# EAGLE design romboard_v2 (EAGLE 9.4.2)
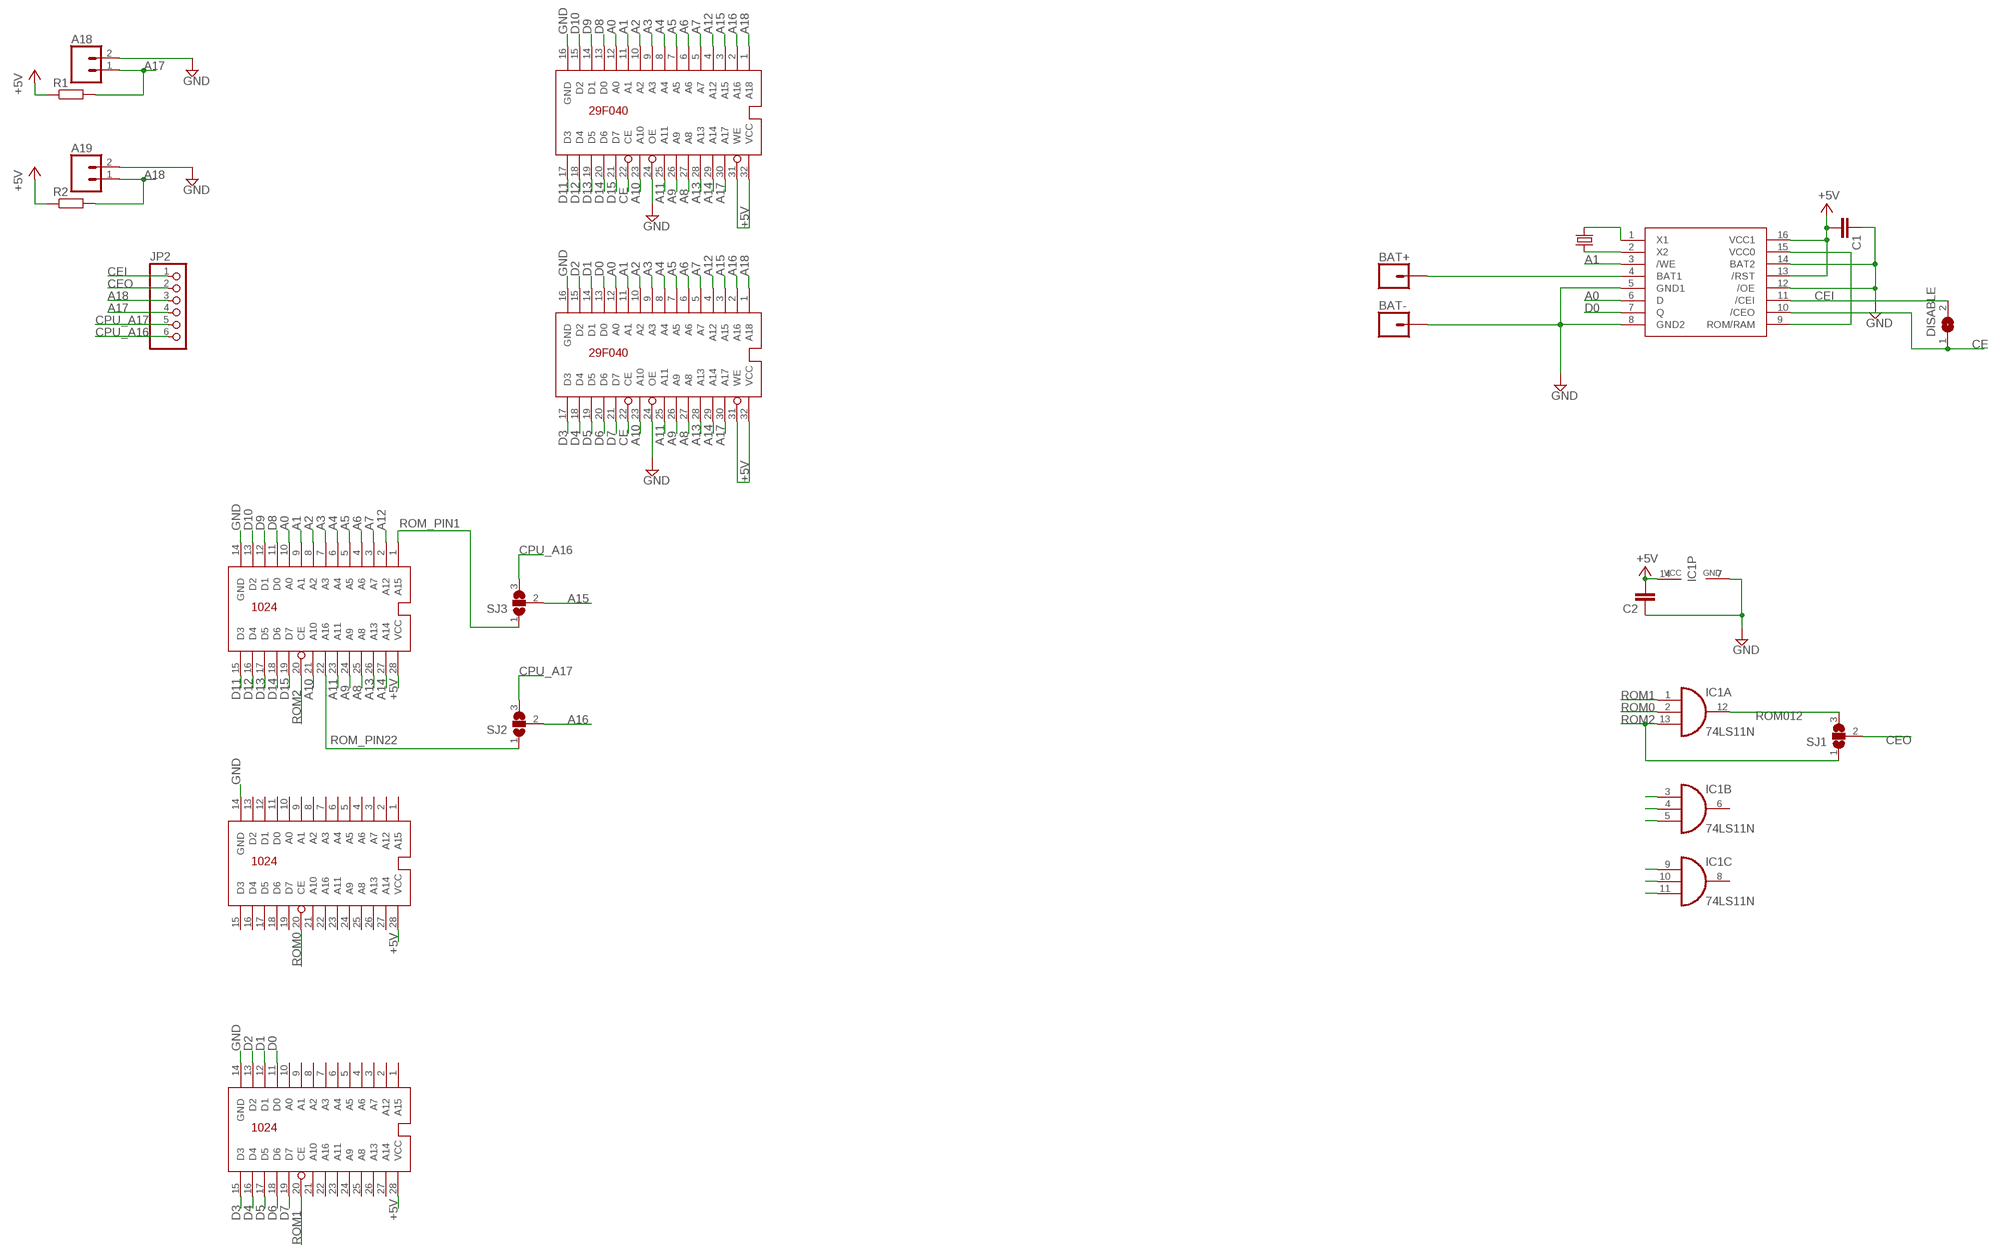
[diagram p0: schematic, sheet 1]

## Parts
32.768KHZ  CRYSTALTC38H  [TC38H]
A18  CONN_02  [1X02]
A19  CONN_02  [1X02]
BAT+  CONN_01  [1X01]
BAT-  CONN_01  [1X01]
C1  C-EU050-025X075  [C050-025X075]
C2  C-EU050-025X075  [C050-025X075]
DISABLE  SJ  [SJ]
HI0_SOCKET  ROM1024  [ROM28PIN]
IC1  74LS11N  [DIL14]
JP2  PINHD-1X6/90  [1X06/90]
LO2_SOCKET  ROM1024  [ROM28PIN]
LO2_SOCKET1  ROM1024  [ROM28PIN]
R1  R-EU_0207/12  [0207/12]
R2  R-EU_0207/12  [0207/12]
SJ1  SJ2W  [SJ_2]
SJ2  SJ2W  [SJ_2]
SJ3  SJ2W  [SJ_2]
U$1  AM29F040  [AM29F040]
U$2  AM29F040  [AM29F040]
U$4  DS1315  [DIL16]

## Nets
+5V: C1.2 C2.2 HI0_SOCKET.28(VCC) IC1.14(P:VCC) LO2_SOCKET1.28(VCC) LO2_SOCKET.28(VCC) R1.1 R2.1 U$1.31(WE) U$1.32(VCC) U$2.31(WE) U$2.32(VCC) U$4.13(/RST) U$4.16(VCC1)
A0: HI0_SOCKET.10(A0) U$1.12(A0) U$2.12(A0) U$4.6(D)
A1: HI0_SOCKET.9(A1) U$1.11(A1) U$2.11(A1) U$4.3(/WE)
A2: HI0_SOCKET.8(A2) U$1.10(A2) U$2.10(A2)
A3: HI0_SOCKET.7(A3) U$1.9(A3) U$2.9(A3)
A4: HI0_SOCKET.6(A4) U$1.8(A4) U$2.8(A4)
A5: HI0_SOCKET.5(A5) U$1.7(A5) U$2.7(A5)
A6: HI0_SOCKET.4(A6) U$1.6(A6) U$2.6(A6)
A7: HI0_SOCKET.3(A7) U$1.5(A7) U$2.5(A7)
A8: HI0_SOCKET.25(A8) U$1.27(A8) U$2.27(A8)
A9: HI0_SOCKET.24(A9) U$1.26(A9) U$2.26(A9)
A10: HI0_SOCKET.21(A10) U$1.23(A10) U$2.23(A10)
A11: HI0_SOCKET.23(A11) U$1.25(A11) U$2.25(A11)
A12: HI0_SOCKET.2(A12) U$1.4(A12) U$2.4(A12)
A13: HI0_SOCKET.26(A13) U$1.28(A13) U$2.28(A13)
A14: HI0_SOCKET.27(A14) U$1.29(A14) U$2.29(A14)
A15: SJ3.2 U$1.3(A15) U$2.3(A15)
A16: SJ2.2 U$1.2(A16) U$2.2(A16)
A17: A18.1 JP2.4 R1.2 U$1.30(A17) U$2.30(A17)
A18: A19.1 JP2.3 R2.2 U$1.1(A18) U$2.1(A18)
BAT: BAT+.1 U$4.4(BAT1)
CE: DISABLE.1 U$1.22(CE) U$2.22(CE) U$4.10(/CEO)
CEI: DISABLE.2 JP2.1 U$4.11(/CEI)
CEO: JP2.2 SJ1.2
CPU_A16: JP2.6 SJ3.3
CPU_A17: JP2.5 SJ2.3
D0: LO2_SOCKET.11(D0) U$1.13(D0) U$4.7(Q)
D1: LO2_SOCKET.12(D1) U$1.14(D1)
D2: LO2_SOCKET.13(D2) U$1.15(D2)
D3: LO2_SOCKET.15(D3) U$1.17(D3)
D4: LO2_SOCKET.16(D4) U$1.18(D4)
D5: LO2_SOCKET.17(D5) U$1.19(D5)
D6: LO2_SOCKET.18(D6) U$1.20(D6)
D7: LO2_SOCKET.19(D7) U$1.21(D7)
D8: HI0_SOCKET.11(D0) U$2.13(D0)
D9: HI0_SOCKET.12(D1) U$2.14(D1)
D10: HI0_SOCKET.13(D2) U$2.15(D2)
D11: HI0_SOCKET.15(D3) U$2.17(D3)
D12: HI0_SOCKET.16(D4) U$2.18(D4)
D13: HI0_SOCKET.17(D5) U$2.19(D5)
D14: HI0_SOCKET.18(D6) U$2.20(D6)
D15: HI0_SOCKET.19(D7) U$2.21(D7)
GND: A18.2 A19.2 BAT-.1 C1.1 C2.1 HI0_SOCKET.14(GND) IC1.7(P:GND) LO2_SOCKET1.14(GND) LO2_SOCKET.14(GND) U$1.16(GND) U$1.24(OE) U$2.16(GND) U$2.24(OE) U$4.5(GND1) U$4.8(GND2) U$4.12(/OE) U$4.14(BAT2)
N$2: U$4.9(ROM/RAM) U$4.15(VCC0)
N$3: IC1.11(C:I2)
N$4: IC1.10(C:I1)
N$5: IC1.9(C:I0)
N$6: IC1.5(B:I2)
N$7: IC1.4(B:I1)
N$8: IC1.3(B:I0)
ROM0: IC1.2(A:I1) LO2_SOCKET1.20(CE)
ROM1: IC1.1(A:I0) LO2_SOCKET.20(CE)
ROM2: HI0_SOCKET.20(CE) IC1.13(A:I2) SJ1.1
ROM012: IC1.12(A:O) SJ1.3
ROM_PIN1: HI0_SOCKET.1(A15) SJ3.1
ROM_PIN22: HI0_SOCKET.22(A16) SJ2.1
X1: 32.768KHZ.2 U$4.1(X1)
X2: 32.768KHZ.1 U$4.2(X2)
Unconnected: IC1.6(B:O) IC1.8(C:O) LO2_SOCKET1.1(A15) LO2_SOCKET1.2(A12) LO2_SOCKET1.3(A7) LO2_SOCKET1.4(A6) LO2_SOCKET1.5(A5) LO2_SOCKET1.6(A4) LO2_SOCKET1.7(A3) LO2_SOCKET1.8(A2) LO2_SOCKET1.9(A1) LO2_SOCKET1.10(A0) LO2_SOCKET1.11(D0) LO2_SOCKET1.12(D1) LO2_SOCKET1.13(D2) LO2_SOCKET1.15(D3) LO2_SOCKET1.16(D4) LO2_SOCKET1.17(D5) LO2_SOCKET1.18(D6) LO2_SOCKET1.19(D7) LO2_SOCKET1.21(A10) LO2_SOCKET1.22(A16) LO2_SOCKET1.23(A11) LO2_SOCKET1.24(A9) LO2_SOCKET1.25(A8) LO2_SOCKET1.26(A13) LO2_SOCKET1.27(A14) LO2_SOCKET.1(A15) LO2_SOCKET.2(A12) LO2_SOCKET.3(A7) LO2_SOCKET.4(A6) LO2_SOCKET.5(A5) LO2_SOCKET.6(A4) LO2_SOCKET.7(A3) LO2_SOCKET.8(A2) LO2_SOCKET.9(A1) LO2_SOCKET.10(A0) LO2_SOCKET.21(A10) LO2_SOCKET.22(A16) LO2_SOCKET.23(A11) LO2_SOCKET.24(A9) LO2_SOCKET.25(A8) LO2_SOCKET.26(A13) LO2_SOCKET.27(A14)

## Library data of the parts
32.768KHZ = crystal:CRYSTAL: CRYSTAL; OC_FARNELL: unknown; OC_NEWARK: unknown
A18 A19 = SparkFun-Connectors:CONN_02: Multi connection point. Often used as Generic Header-pin footprint for 0.1 inch spaced/style header connections On any of the 0.1 inch spaced packages, you can populate with these: Break Away Headers - Straight <https://www.sparkfun.com/products/116> (PRT-00116) Break Away Male Headers - Right Angle <https://www.sparkfun.com/products/553> (PRT-00553) Female Headers <https://www.sparkfun.com/products/115> (PRT-00115) Break Away Headers - Machine Pin <https://www.sparkfun.com/products/117> (PRT-00117) Break Away Female Headers - Swiss Machine Pin <https://www.sparkfun.com/products/743> (PRT-00743) For SCREWTERMINALS and SPRING TERMINALS visit here: Screw Terimnals on SparkFun.com <https://www.sparkfun.com/search/results?term=Screw+Terminals> (5mm/3.5mm/2.54mm spacing) This device is also useful as a general connection point to wire up your design to another part of your project. Our various solder wires solder well into these plated through hole pads. Hook-Up Wire - Assortment (Stranded, 22 AWG) <https://www.sparkfun.com/products/11375> (PRT-11375) Hook-Up Wire - Assortment (Solid Core, 22 AWG) <https://www.sparkfun.com/products/11367> (PRT-11367) View the entire wire category on our website here <https://www.sparkfun.com/categories/141> Special notes: Molex polarized connector foot print use with: PRT-08233 with associated crimp pins and housings. 2.54_SCREWTERM for use with PRT-10571. 3.5mm Screw Terminal footprints for PRT-08084 5mm Screw Terminal footprints for use with PRT-08432
BAT+ BAT- = SparkFun-Connectors:CONN_01: Single connection point. Often used as Generic Header-pin footprint for 0.1 inch spaced/style header connections On any of the 0.1 inch spaced packages, you can populate with these: Break Away Headers - Straight <https://www.sparkfun.com/products/116> (PRT-00116) Break Away Male Headers - Right Angle <https://www.sparkfun.com/products/553> (PRT-00553) Female Headers <https://www.sparkfun.com/products/115> (PRT-00115) Break Away Headers - Machine Pin <https://www.sparkfun.com/products/117> (PRT-00117) Break Away Female Headers - Swiss Machine Pin <https://www.sparkfun.com/products/743> (PRT-00743) This device is also useful as a general connection point to wire up your design to another part of your project. Our various solder wires solder well into these plated through hole pads. Hook-Up Wire - Assortment (Stranded, 22 AWG) <https://www.sparkfun.com/products/11375> (PRT-11375) Hook-Up Wire - Assortment (Solid Core, 22 AWG) <https://www.sparkfun.com/products/11367> (PRT-11367) View the entire wire category on our website here <https://www.sparkfun.com/categories/141> Special notes: SMTSO-256-ET is a "flush mount" nut for a 4-40 screw. We mostly use this on specialty testbeds; it is a nice way to connect hardware to your PCB at an adjustable hieght. Also note, the SNAP packages are for using a snappable style connector. We sell a baggie of snaps and they are also used on two LilyPad designs: Snap Assortment - 30 pack (male and female) <https://www.sparkfun.com/products/11347> (DEV-11347) LilyPad Arduino SimpleSnap <https://www.sparkfun.com/products/10941> (DEV-10941) LilyPad SimpleSnap Protoboard <https://www.sparkfun.com/products/10940> (DEV-10940)
C1 C2 = rcl:C-EU: CAPACITOR, European symbol; SPICEPREFIX: C
DISABLE = jumper:SJ: SMD solder JUMPER
HI0_SOCKET LO2_SOCKET LO2_SOCKET1 = AtariST:ROM1024
IC1 = 74xx-eu:74*11: Triple 3-input AND gate
JP2 = pinhead:PINHD-1X6: PIN HEADER
R1 R2 = rcl:R-EU_: RESISTOR, European symbol; SPICEPREFIX: R
SJ1-SJ3 = jumper:SJ2W: SMD solder JUMPER
U$1 U$2 = AtariST:AM29F040
U$4 = AtariST:DS1315

## Net classes
1 +5V: width 0.406 mm
2 GND: width 0.406 mm

## Board
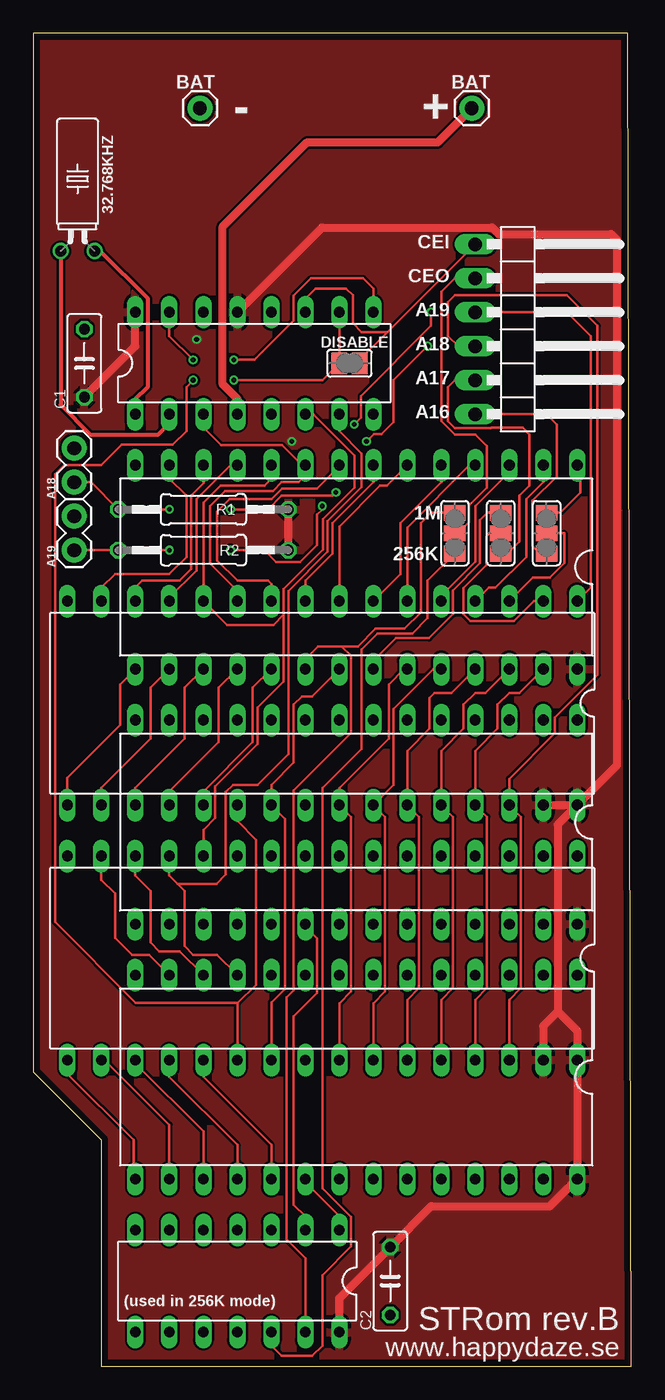
[diagram p1: board, top side]
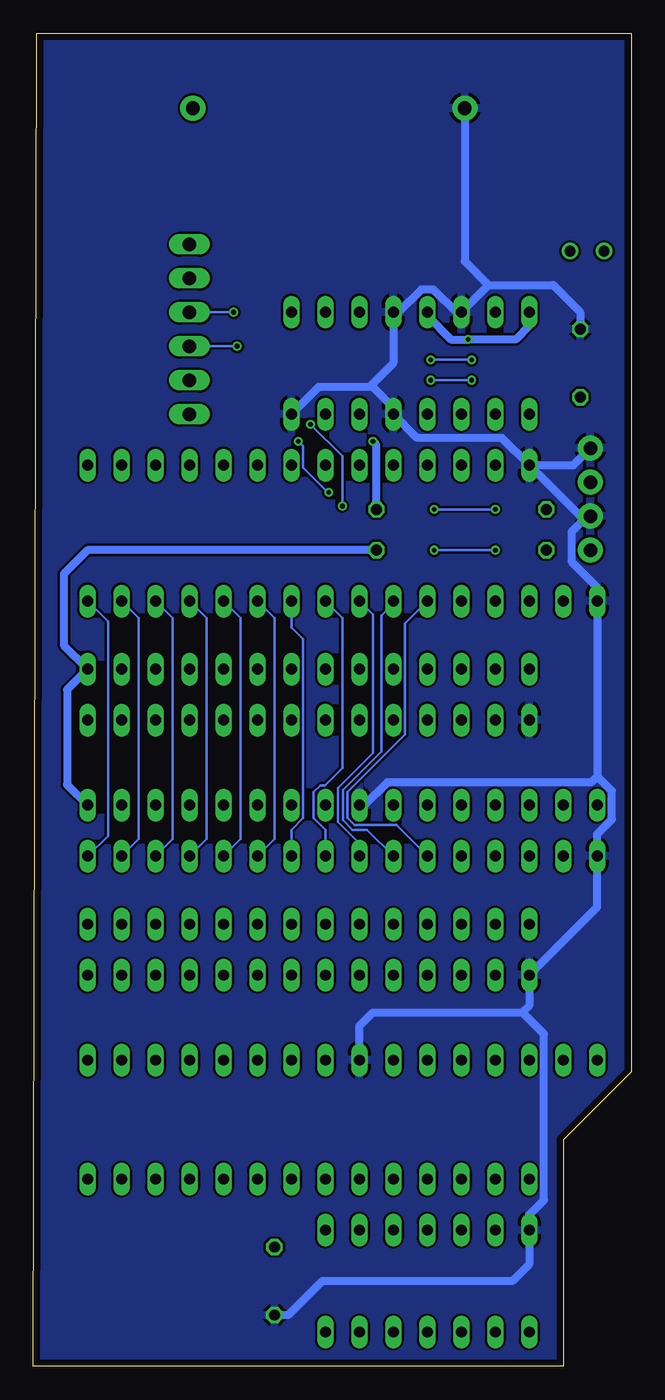
[diagram p2: board, bottom side, seen from below]

Size 44.68 x 99.57 mm. Coordinates in mm from the lower left corner, seen from the top.
Outline: 5.08,0 44.68,0 44.43,99.57 0,99.57 0,21.97 5.08,16.89 5.08,0
Copper layers (1*16): Top 0.035mm / dielectric 1.6mm / Bottom 0.035mm
Design rules "Elecrow_2-layer_PCB_eagle_rule *": minimum track width 7mil, minimum drill 12mil, track to track 7mil, track to pad 7mil, pad to pad 7mil, via to via 8mil, smd to smd 0mil, copper to edge 20mil, drill to drill 10mil, minimum pad ring 6mil, minimum via ring 6mil, stop-mask expansion 0mil, vias tented up to drill 100mil, thermal gap 10mil

### Footprints (pad centres in the part's own frame; a part is rotated, then mirrored left to right if it is on the bottom)
TC38H = drill 0.813: 1 -1.27,0; 2 1.27,0
1X02 = drill 1.016 pad 1.88: 1 0,0; 2 2.54,0
1X01 = drill 1.016 pad 1.88: 1 0,0
C050-025X075 = drill 0.813 octagon: 1 -2.54,0; 2 2.54,0
SJ = smd 1.168 x 1.6: 1 -0.762,0; 2 0.762,0
ROM28PIN = drill 0.813 long: 1 -16.51,-7.62; 2 -13.97,-7.62; 3 -11.43,-7.62; 4 -8.89,-7.62; 5 -6.35,-7.62; 6 -3.81,-7.62; 7 -1.27,-7.62; 8 1.27,-7.62; 9 3.81,-7.62; 10 6.35,-7.62; 11 8.89,-7.62; 12 11.43,-7.62; 13 13.97,-7.62; 14 16.51,-7.62; 15 16.51,7.62; 16 13.97,7.62; 17 11.43,7.62; 18 8.89,7.62; 19 6.35,7.62; 20 3.81,7.62; 21 1.27,7.62; 22 -1.27,7.62; 23 -3.81,7.62; 24 -6.35,7.62; 25 -8.89,7.62; 26 -11.43,7.62; 27 -13.97,7.62; 28 -16.51,7.62
DIL14 = drill 0.813 long: 1 -7.62,-3.81; 2 -5.08,-3.81; 3 -2.54,-3.81; 4 0,-3.81; 5 2.54,-3.81; 6 5.08,-3.81; 7 7.62,-3.81; 8 7.62,3.81; 9 5.08,3.81; 10 2.54,3.81; 11 0,3.81; 12 -2.54,3.81; 13 -5.08,3.81; 14 -7.62,3.81
1X06/90 = drill 1.016 long: 1 -6.35,-3.81; 2 -3.81,-3.81; 3 -1.27,-3.81; 4 1.27,-3.81; 5 3.81,-3.81; 6 6.35,-3.81
0207/12 = drill 0.813 octagon: 1 -6.35,0; 2 6.35,0
SJ_2 = smd 1.168 x 1.6: 1 -1.524,0; 2 0,0; 3 1.524,0
AM29F040 = drill 0.813 long: 1 -19.05,-7.62; 2 -16.51,-7.62; 3 -13.97,-7.62; 4 -11.43,-7.62; 5 -8.89,-7.62; 6 -6.35,-7.62; 7 -3.81,-7.62; 8 -1.27,-7.62; 9 1.27,-7.62; 10 3.81,-7.62; 11 6.35,-7.62; 12 8.89,-7.62; 13 11.43,-7.62; 14 13.97,-7.62; 15 16.51,-7.62; 16 19.05,-7.62; 17 19.05,7.62; 18 16.51,7.62; 19 13.97,7.62; 20 11.43,7.62; 21 8.89,7.62; 22 6.35,7.62; 23 3.81,7.62; 24 1.27,7.62; 25 -1.27,7.62; 26 -3.81,7.62; 27 -6.35,7.62; 28 -8.89,7.62; 29 -11.43,7.62; 30 -13.97,7.62; 31 -16.51,7.62; 32 -19.05,7.62
DIL16 = drill 0.813 long: 1 0,0; 2 0,-2.54; 3 0,-5.08; 4 0,-7.62; 5 0,-10.16; 6 0,-12.7; 7 0,-15.24; 8 0,-17.78; 9 7.62,-17.78; 10 7.62,-15.24; 11 7.62,-12.7; 12 7.62,-10.16; 13 7.62,-7.62; 14 7.62,-5.08; 15 7.62,-2.54; 16 7.62,0

### Placement (x,y rotation side)
32.768KHZ  3.3,83.31 0 top
A18  3.05,66.04 90 top
A19  3.05,60.96 90 top
BAT+  32.77,93.98 180 top
BAT-  12.45,93.98 180 top
C1  3.81,74.93 270 top
C2  26.67,6.35 90 top
DISABLE  23.62,74.93 0 top
HI0_SOCKET  24.13,59.69 180 top
IC1  15.24,6.35 180 top
JP2  36.83,77.47 270 top
LO2_SOCKET  24.13,21.59 180 top
LO2_SOCKET1  24.13,40.64 180 top
R1  12.7,64.01 180 top
R2  12.7,60.96 180 top
SJ1  31.5,62.23 270 top
SJ2  34.93,62.23 270 top
SJ3  38.35,62.23 270 top
U$1  21.59,30.48 180 top
U$2  21.59,49.53 180 top
U$4  7.62,71.12 90 top

### Tracks (layer width: path | path; a pad name or v marks a point on that pad's centre or on a via)
+5V  (via drill 0.35)
  Top 0.61: U$2.31 U$2.32 | U$2.32 39.19,40.46 39.19,26.49 | U$4.13 21.56,85.06 34.3,85.06 34.78,84.58 43.18,84.58 43.62,84.14 43.62,44.89 U$2.32 | 39.19,26.49 38.1,25.4 U$1.31 | R2.1 R1.1 | IC1.14 22.86,5.08 C2.2 29.72,11.94 38.61,11.94 LO2_SOCKET.28 U$1.32 40.64,25.04 39.19,26.49 | C1.2 7.62,76.2 U$4.16
  Bottom 0.61: R2.1 40.64,60.96 42.42,59.18 42.42,53.85 HI0_SOCKET.28 42.16,50.55 42.16,43.43 U$2.32 | U$4.13 15.24,78.49 13.46,76.71 v12.19,76.71 8.64,76.71 7.62,77.72 U$4.16 | R1.1 19.05,68.83 v19.3,69.09
  pour Top: -0.25,-3.81 -0.25,114.3 55.63,114.3 55.63,-3.81
A0
  Top 0.178: HI0_SOCKET.10 17.78,66.29 17.27,65.79 13.97,65.79 12.7,64.52 U$2.12 14.48,55.37 17.93,55.37 18.69,56.13 | U$4.6 20.32,71.08 20.94,71.08 23.99,68.03 23.99,65.64 21.64,63.29 21.64,61.01 18.69,58.06 18.69,56.13 | U$1.12 12.7,40.06 13.58,40.94 13.58,43.3 16.75,46.47 16.75,49.19 18.69,51.14 18.69,56.13
A1
  Top 0.178: U$2.11 15.24,57.91 13.21,59.94 13.21,64.26 14.34,65.39 17.89,65.39 18.54,66.04 19.81,66.04 20.32,66.55 HI0_SOCKET.9 20.07,67.31 18.58,68.8 14.01,68.8 12.7,70.1 U$4.3
  Bottom 0.178: U$1.11 17.56,40.42 20.68,40.42 21.2,40.94 21.2,42.88 16.9,47.17 16.9,55.49 U$2.11
A2
  Top 0.178: U$2.10 17.78,58.42 17.53,58.67 15.24,58.67 13.72,60.2 13.72,63.83 14.65,64.77 17.78,64.77 18.58,65.57 21.19,65.57 22.86,67.24 HI0_SOCKET.8
  Bottom 0.178: U$1.10 19.75,40.07 20.83,40.07 21.55,40.79 21.55,43.03 18.66,45.92 18.66,56.09 17.78,56.97 U$2.10
A3
  Top 0.178: HI0_SOCKET.7 25.4,66.04 22.35,62.99 22.35,60.71 20.32,58.67 U$2.9
  Bottom 0.178: U$1.9 20.32,39.05 21.91,40.64 21.91,43.19 19.3,45.79 19.3,56.13 U$2.9
A4
  Top 0.178: HI0_SOCKET.6 26.42,65.79 25.91,65.79 22.86,62.74 U$2.8
  Bottom 0.178: U$1.8 22.86,40.06 23.74,40.94 23.74,42.88 23.22,43.4 22.9,43.4 21.59,44.7 21.59,55.88 U$2.8
A5
  Top 0.178: HI0_SOCKET.5 30.48,66.04 27.43,62.99 27.43,59.18 U$2.7
  Bottom 0.178: U$1.7 25.4,40.06 24.52,40.94 24.52,54.31 25.4,55.19 U$2.7
A6
  Top 0.178: U$2.6 27.94,62.67 32.58,67.31 HI0_SOCKET.4
  Bottom 0.178: U$1.6 26.67,39.37 26.67,55.88 U$2.6
A7
  Top 0.178: U$2.5 30.48,57.59 33.02,60.13 33.02,64.26 35.56,66.8 HI0_SOCKET.3
  Bottom 0.178: U$1.5 29.21,39.37 29.21,55.88 U$2.5
A8
  Top 0.178: U$1.27 27.94,27.36 28.82,28.24 28.82,41.03 U$2.27 27.94,45.97 29.6,47.64 29.6,49.92 29.97,50.29 31.24,50.29 HI0_SOCKET.25
A9
  Top 0.178: U$1.26 25.4,27.11 26.28,27.98 26.28,41.03 U$2.26 26.92,43.43 26.92,49.09 29.9,52.07 HI0_SOCKET.24
A10
  Top 0.178: U$1.23 17.78,27.18 18.8,28.19 18.8,40.89 U$2.23 17.78,43.43 19.44,45.1 19.44,49.42 20.07,50.04 20.83,50.04 HI0_SOCKET.21
A11
  Top 0.178: U$1.25 22.86,27.11 23.74,27.98 23.74,41.03 U$2.25 22.86,43.18 26.56,46.88 26.56,50.94 27.69,52.07 HI0_SOCKET.23
A12
  Top 0.178: HI0_SOCKET.2 38.1,66.04 36.83,64.77 36.83,60.45 34.54,58.17 34.04,58.17 U$2.4
  Bottom 0.178: U$1.4 31.75,39.37 31.75,55.88 U$2.4
A13
  Top 0.178: U$1.28 30.48,27.36 31.36,28.24 31.36,41.03 U$2.28 30.48,45.97 32.14,47.64 32.14,49.42 33.02,50.29 33.78,50.29 HI0_SOCKET.26
A14
  Top 0.178: U$1.29 33.02,27.36 33.9,28.24 33.9,41.03 U$2.29 33.02,45.97 34.68,47.64 34.68,49.42 35.56,50.29 36.32,50.29 HI0_SOCKET.27
A15
  Top 0.178: SJ3.2 39.68,62.23 39.68,59.99 38.61,58.93 37.34,58.93 U$2.3
  Bottom 0.178: U$1.3 34.29,39.37 34.29,55.88 U$2.3
A16
  Top 0.178: SJ2.2 34.11,62.23 33.86,61.98 33.86,59.84 32.14,58.12 32.14,56.18 32.66,55.66 35.92,55.66 37.41,57.15 U$2.2
  Bottom 0.178: U$1.2 36.83,39.37 36.83,55.88 U$2.2
A17  (via drill 0.35)
  Top 0.178: U$1.30 35.56,27.36 36.44,28.24 36.44,41.03 U$2.30 35.56,43.87 38.98,47.29 38.98,48.45 42.16,51.63 42.16,77.72 39.88,80.01 31.5,80.01 30.99,79.5 30.99,76.96 31.75,76.2 JP2.4 | A18.1 4.32,66.04 R1.2 v10.16,64.01 | v14.73,64.01 17.53,64.01 18.54,65.02 22.35,65.02 v22.61,65.28 | v24.89,69.09 25.44,69.63 26.02,69.63 26.92,70.54 26.92,73.66 v29.46,76.2
  Bottom 0.178: v10.16,64.01 v14.73,64.01 | v22.61,65.28 22.68,65.28 24.52,67.12 24.52,68.72 v24.89,69.09 | v29.46,76.2 JP2.4
A18  (via drill 0.35)
  Top 0.178: U$2.1 41.66,58.17 41.66,76.96 39.88,78.74 JP2.3 | A19.1 R2.2 v10.16,60.96 | v21.59,64.26 21.59,64.01 21.2,63.61 21.2,61.36 19.92,60.08 18.15,60.08 17.27,60.96 v14.73,60.96 | v23.97,70.36 24.48,70.87 24.48,72.49 29.72,77.72 v29.72,78.74
  Bottom 0.178: v14.73,60.96 v10.16,60.96 | v21.59,64.26 21.59,67.97 v23.97,70.36 | v29.72,78.74 JP2.3 | U$1.1 39.12,39.62 39.12,55.63 U$2.1
BAT
  Top 0.61: BAT+.1 30.23,91.44 20.45,91.44 14.15,85.14 14.15,73.35 15.24,72.26 U$4.4
CE  (via drill 0.35)
  Top 0.178: U$4.10 DISABLE.1 21.59,73.66 v14.99,73.66 | U$1.22 15.24,27.11 15.28,27.14 | U$2.22 15.24,40.71 16.62,39.33 16.62,28.49 15.28,27.14 | v11.94,73.66 11.43,73.15 11.43,69.85 10.41,68.83 6.6,68.83 5.08,67.31 2.29,67.31 1.61,66.64 1.61,33.19 7.65,27.14 15.28,27.14
  Bottom 0.178: v14.99,73.66 v11.94,73.66
CEI
  Top 0.178: JP2.1 26.45,77.25 | 26.45,77.25 24.53,77.25 23.88,77.91 23.88,80.01 23.37,80.52 21.08,80.52 20.32,79.76 U$4.11 | 26.45,77.25 24.38,75.18 DISABLE.2
CEO
  Top 0.178: JP2.2 31.5,81.28 30.48,80.26 30.48,70.61 31.5,69.6 33.02,69.6 33.9,68.72 33.9,65.64 32.56,64.31 32.56,63.06 31.73,62.23 SJ1.2
CPU_A16
  Top 0.178: SJ3.3 37.86,60.71 37.29,61.28 37.29,64.65 39.12,66.48 39.12,70.36 38.35,71.12 JP2.6
CPU_A17
  Top 0.178: SJ2.3 35.43,60.71 36.32,61.59 36.32,65.02 37.08,65.79 37.08,69.6 36.58,70.1 34.22,70.1 34.21,70.09 31.51,70.09 30.99,70.61 30.99,73.13 31.52,73.66 JP2.5
D0
  Top 0.178: LO2_SOCKET.11 13.72,30.73 11.94,30.73 11.29,31.38 11.29,35.52 10.78,36.02 | U$1.13 10.16,36.65 10.78,36.02 | U$4.7 22.86,69.85 24.52,68.19 24.52,65.67 22,63.14 22,60.86 19.05,57.91 19.05,45.72 16.76,43.43 14.92,43.43 14.36,42.88 14.36,36.72 13.67,36.02 10.78,36.02
D1
  Top 0.178: LO2_SOCKET.12 10.92,30.99 9.4,30.99 8.75,31.64 8.75,35.52 7.62,36.65 U$1.14
D2
  Top 0.178: LO2_SOCKET.13 8.64,30.73 7.37,30.73 6.1,32 6.1,35.31 5.08,36.32 U$1.15
D3
  Top 0.178: LO2_SOCKET.15 7.48,14.11 7.48,16.88 2.54,21.83 U$1.17
D4
  Top 0.178: LO2_SOCKET.16 10.16,18.03 5.08,23.11 U$1.18
D5
  Top 0.178: LO2_SOCKET.17 12.7,17.53 7.62,22.61 U$1.19
D6
  Top 0.178: LO2_SOCKET.18 15.24,16.51 10.16,21.59 U$1.20
D7
  Top 0.178: LO2_SOCKET.19 17.78,16.51 12.7,21.59 U$1.21
D8
  Top 0.178: U$2.13 10.16,57.4 12.19,59.44 12.19,64.77 14.73,67.31 HI0_SOCKET.11
D9
  Top 0.178: U$2.14 7.62,58.17 8.13,58.67 10.92,58.67 11.79,59.54 11.79,65.06 12.7,65.97 HI0_SOCKET.12
D10
  Top 0.178: U$2.15 5.08,58.17 6.1,59.18 10.16,59.18 11.43,60.45 11.43,65.02 10.16,66.29 HI0_SOCKET.13
D11
  Top 0.178: U$2.17 2.54,43.94 6.49,47.89 6.49,50.94 HI0_SOCKET.15
D12
  Top 0.178: U$2.18 5.08,43.18 8.78,46.88 8.78,50.69 HI0_SOCKET.16
D13
  Top 0.178: U$2.19 7.62,43.18 11.32,46.88 11.32,50.69 HI0_SOCKET.17
D14
  Top 0.178: U$2.20 10.16,42.93 13.86,46.62 13.86,50.69 HI0_SOCKET.18
D15
  Top 0.178: U$2.21 12.7,42.93 16.4,46.62 16.4,50.69 HI0_SOCKET.19
GND
  Bottom 0.61: HI0_SOCKET.14 4.32,67.31 A18.2 | HI0_SOCKET.14 3.81,63.5 A19.2 3.28,63.5 4.47,62.31 4.47,60.12 2.54,58.19 U$2.16 2.54,44.06 | HI0_SOCKET.14 9.65,69.34 16,69.34 U$4.5 17.78,71.63 19.3,73.15 19.56,73.15 | 19.56,73.15 23.37,73.15 U$4.8 | 19.56,73.15 17.78,74.93 U$4.12 17.39,78.74 15.69,80.44 14.79,80.44 13.09,78.74 U$4.14 10.67,80.77 | 2.54,44.06 1.45,42.97 1.45,40.85 2.54,39.76 U$1.16 2.54,34.29 LO2_SOCKET.14 7.62,26.92 8.13,26.42 | 2.54,44.06 2.99,43.61 18.23,43.61 19.93,41.91 U$2.24 | U$1.24 20.32,25.4 19.3,26.42 8.13,26.42 | 8.13,26.42 6.53,24.82 6.53,12.4 7.62,11.31 IC1.7 7.62,7.62 8.89,6.35 23.11,6.35 25.65,3.81 C2.1 | 10.67,80.77 5.84,80.77 3.81,78.74 C1.1 | BAT-.1 12.45,82.55 10.67,80.77
  pour Bottom: -0.25,-1.02 -0.25,109.22 48.01,109.22 48.01,-1.02
N$2  (via drill 0.35)
  Top 0.178: v11.94,75.18 10.16,76.96 U$4.15 | v14.99,75.18 16.51,75.18 19.44,78.12 19.44,79.97 20.76,81.28 24.64,81.28 25.4,80.52 U$4.9
  Bottom 0.178: v14.99,75.18 v11.94,75.18
ROM0
  Top 0.178: IC1.2 20.32,11.18 19.44,12.06 19.44,26.12 21.2,27.87 21.2,31.96 20.32,32.84 LO2_SOCKET1.20
ROM1
  Top 0.178: IC1.1 22.86,11.18 20.32,13.72 LO2_SOCKET.20
ROM2
  Top 0.178: SJ1.1 29.72,63.75 28.96,62.99 28.96,56.32 27.74,55.1 25.58,55.1 24.25,53.78 23.04,53.78 | IC1.13 20.32,8.06 18.91,9.47 18.91,27.55 19.44,28.08 19.44,42.99 23.74,47.29 23.74,53.09 23.04,53.78 | 23.04,53.78 21.27,53.78 20.32,52.83 HI0_SOCKET.20
ROM012
  Top 0.178: SJ1.3 29.46,58.67 29.46,55.88 28.33,54.75 25.72,54.75 24.52,53.55 24.52,46.11 21.59,43.18 21.59,13.28 23.74,11.13 23.74,8.93 21.59,6.79 21.59,1.52 20.83,0.76 18.54,0.76 17.78,1.52 IC1.12
ROM_PIN1
  Top 0.178: SJ3.1 39.37,63.75 40.89,65.28 40.89,67.06 HI0_SOCKET.1
ROM_PIN22
  Top 0.178: SJ2.1 33.93,63.75 33.38,63.2 33.38,59.98 31.36,57.96 31.36,56.18 29.57,54.39 27.09,54.39 25.4,52.7 HI0_SOCKET.22
X1
  Top 0.305: U$4.1 7.62,72.25 8.56,73.19 8.56,79.74 4.99,83.31 32.768KHZ.2
X2
  Top 0.305: U$4.2 10.16,70.45 9.28,69.57 4.28,69.57 2.03,71.82 32.768KHZ.1

### Text on the board
tPlace: 1M | 256K
tNames: BAT | BAT | - | + | CEI | CEO | A19 | A18 | A17 | A16 | (used in 256K mode) | STRom rev.B | www.happydaze.se